# Altium schematic sheet CPU.SchDoc
size A; PageSetup: Record=PageOptions|CenterHorizontal=True|CenterVertical=True|PrintScale=1.05|XCorrection=1.00|YCorrection=1.00|PrintKind=1|BorderSize=5000000|LeftOffset=0|BottomOffset=0|Orientation=2|PaperLength=1000|PaperWidth=1000|Scale=100|PaperSource=262|PrintQuality=600|MediaType=1|DitherType=10|PaperKind=Letter|PrintScaleMode=1
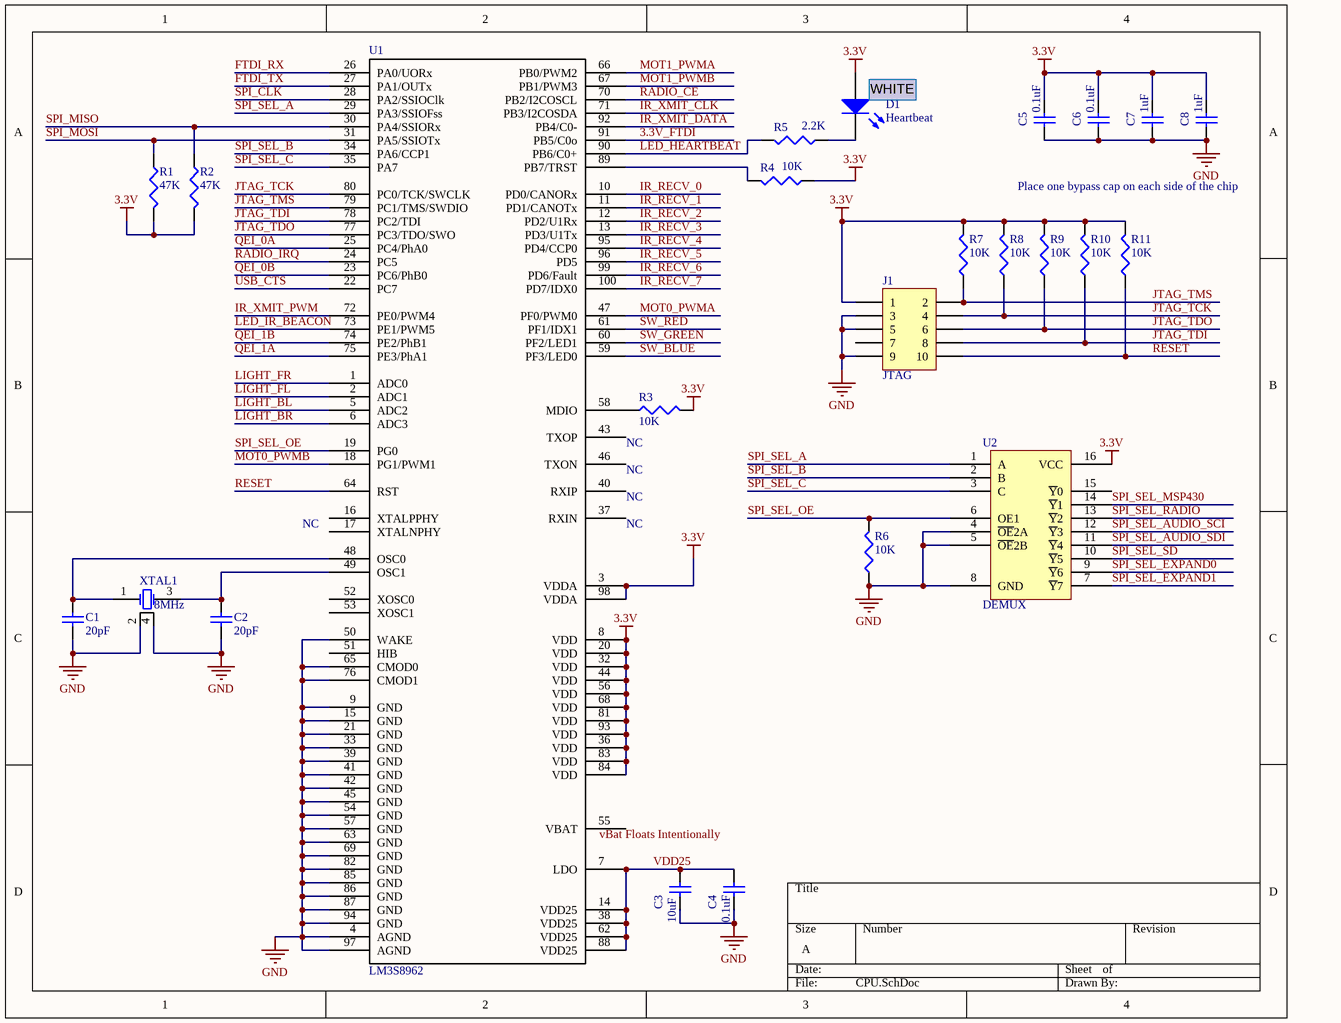
[diagram p0: CPU.SchDoc]

## Parts
C1  value 20pF  [CAPC1005L]  (hidden comment: Cap Semi)
C2  value 20pF  [CAPC1005L]  (hidden comment: Cap Semi)
C3  value 10uF  [CAPC1608L]  (hidden comment: Cap Semi)
C4  value 0.1uF  [CAPC1005L]  (hidden comment: Cap Semi)
C5  value 0.1uF  [CAPC1005L]  (hidden comment: Cap Semi)
C6  value 0.1uF  [CAPC1005L]  (hidden comment: Cap Semi)
C7  value 1uF  [CAPC1608L]  (hidden comment: Cap Semi)
C8  value 1uF  [CAPC1608L]  (hidden comment: Cap Semi)
D1  Heartbeat  [SurfaceMount(603)]
J1  JTAG  [JTAG-10]
R1  value 47K  [RESC1608L]  (hidden comment: Res3)
R2  value 47K  [RESC1608L]  (hidden comment: Res3)
R3  value 10K  [RESC1608L]  (hidden comment: Res3)
R4  value 10K  [RESC1608L]  (hidden comment: Res3)
R5  value 2.2K  [RESC1608L]  (hidden comment: Res3)
R6  value 10K  [RESC1608L]  (hidden comment: Res3)
R7  value 10K  [RESC1608L]  (hidden comment: Res3)
R8  value 10K  [RESC1608L]  (hidden comment: Res3)
R9  value 10K  [RESC1608L]  (hidden comment: Res3)
R10  value 10K  [RESC1608L]  (hidden comment: Res3)
R11  value 10K  [RESC1608L]  (hidden comment: Res3)
U1  LM3S8962  [LQFP-100]
U2  DEMUX  [TSSOP-16]
XTAL1  8MHz  [CRYSTAL]

## Nets
3.3V: C5.2 C6.2 C7.2 C8.2 D1.1(A) J1.1 R1.2 R2.2 R3.2 R4.1 R7.2 R8.2 R9.2 R10.2 R11.2 U1.3(VDDA) U1.8(VDD) U1.20(VDD) U1.32(VDD) U1.36(VDD) U1.44(VDD) U1.56(VDD) U1.68(VDD) U1.81(VDD) U1.83(VDD) U1.84(VDD) U1.93(VDD) U1.98(VDDA) U2.16(VCC)
GND: C1.1 C2.1 C3.1 C4.1 C5.1 C6.1 C7.1 C8.1 J1.3 J1.5 J1.9 R6.1 U1.4(AGND) U1.9(GND) U1.15(GND) U1.21(GND) U1.33(GND) U1.39(GND) U1.41(GND) U1.42(GND) U1.45(GND) U1.50(WAKE) U1.54(GND) U1.57(GND) U1.63(GND) U1.65(CMOD0) U1.69(GND) U1.76(CMOD1) U1.82(GND) U1.85(GND) U1.86(GND) U1.87(GND) U1.94(GND) U1.97(AGND) U2.4(~{OE}2A) U2.5(~{OE}2B) U2.8(GND) XTAL1.2(GND) XTAL1.4(GND)
3.3V_FTDI: U1.91(PB5/C0o)
FTDI_RX: U1.26(PA0/UORx)
FTDI_TX: U1.27(PA1/OUTx)
IR_RECV_0: U1.10(PD0/CANORx)
IR_RECV_1: U1.11(PD1/CANOTx)
IR_RECV_2: U1.12(PD2/U1Rx)
IR_RECV_3: U1.13(PD3/U1Tx)
IR_RECV_4: U1.95(PD4/CCP0)
IR_RECV_5: U1.96(PD5)
IR_RECV_6: U1.99(PD6/Fault)
IR_RECV_7: U1.100(PD7/IDX0)
IR_XMIT_CLK: U1.71(PB3/I2COSDA)
IR_XMIT_DATA: U1.92(PB4/C0-)
IR_XMIT_PWM: U1.72(PE0/PWM4)
JTAG_TCK: J1.4 R8.1 U1.80(PC0/TCK/SWCLK)
JTAG_TDI: J1.8 R10.1 U1.78(PC2/TDI)
JTAG_TDO: J1.6 R9.1 U1.77(PC3/TDO/SWO)
JTAG_TMS: J1.2 R7.1 U1.79(PC1/TMS/SWDIO)
LED_HEARTBEAT: R5.2 U1.90(PB6/C0+)
LED_IR_BEACON: U1.73(PE1/PWM5)
LIGHT_BL: U1.5(ADC2)
LIGHT_BR: U1.6(ADC3)
LIGHT_FL: U1.2(ADC1)
LIGHT_FR: U1.1(ADC0)
MOT0_PWMA: U1.47(PF0/PWM0)
MOT0_PWMB: U1.18(PG1/PWM1)
MOT1_PWMA: U1.66(PB0/PWM2)
MOT1_PWMB: U1.67(PB1/PWM3)
QEI_0A: U1.25(PC4/PhA0)
QEI_0B: U1.23(PC6/PhB0)
QEI_1A: U1.75(PE3/PhA1)
QEI_1B: U1.74(PE2/PhB1)
RADIO_CE: U1.70(PB2/I2COSCL)
RADIO_IRQ: U1.24(PC5)
RESET: J1.10 R11.1 U1.64(RST)
SPI_CLK: U1.28(PA2/SSIOClk)
SPI_MISO: R2.1 U1.30(PA4/SSIORx)
SPI_MOSI: R1.1 U1.31(PA5/SSIOTx)
SPI_SEL_A: U1.29(PA3/SSIOFss) U2.1(A)
SPI_SEL_AUDIO_SCI: U2.12(~{Y}3)
SPI_SEL_AUDIO_SDI: U2.11(~{Y}4)
SPI_SEL_B: U1.34(PA6/CCP1) U2.2(B)
SPI_SEL_C: U1.35(PA7) U2.3(C)
SPI_SEL_EXPAND0: U2.9(~{Y}6)
SPI_SEL_EXPAND1: U2.7(~{Y}7)
SPI_SEL_MSP430: U2.14(~{Y}1)
SPI_SEL_OE: R6.2 U1.19(PG0) U2.6(OE1)
SPI_SEL_RADIO: U2.13(~{Y}2)
SPI_SEL_SD: U2.10(~{Y}5)
SW_BLUE: U1.59(PF3/LED0)
SW_GREEN: U1.60(PF2/LED1)
SW_RED: U1.61(PF1/IDX1)
USB_CTS: U1.22(PC7)
VDD25: C3.2 C4.2 U1.7(LDO) U1.14(VDD25) U1.38(VDD25) U1.62(VDD25) U1.88(VDD25)
NetC1_2: C1.2 U1.48(OSC0) XTAL1.1(OSC1)
NetC2_2: C2.2 U1.49(OSC1) XTAL1.3(OSC2)
NetD1_2: D1.2(K) R5.1
NetR3_1: R3.1 U1.58(MDIO)
NetR4_2: R4.2 U1.89(PB7/TRST)

Not connected (* = marked no-connect by the designer): J1 7; U1 16(XTALPPHY) 17(XTALNPHY) 37(RXIN) 40(RXIP) 43(TXOP) 46(TXON) 51(HIB) 52(XOSC0) 53(XOSC1) 55(VBAT); U2 15(~{Y}0)

## Notes on the sheet
- (near D1) WHITE
- Place one bypass cap on each side of the chip
- NC
- (near U1) NC
- (near U1) vBat Floats Intentionally

## Library data of the parts
C1-C8 = Cap Semi: Capacitor (Semiconductor SIM Model); Published: 8-Jun-2000; LatestRevisionDate: 29-May-2009; LatestRevisionNote: IPC-7351 Footprint Added.; PackageReference: C1206; Publisher: Altium Limited; PackageDescription: Chip Capacitor
D1 = LED
J1 = Header 5X2H: Header, 5-Pin, Dual row, Right Angle; LatestRevisionDate: 17-Jul-2002; LatestRevisionNote: Re-released for DXP Platform.; Publisher: Altium Limited
R1-R11 = Res3: Resistor; Published: 8-Jun-2000; LatestRevisionDate: 29-May-2009; LatestRevisionNote: IPC-7351 Footprint Added.; PackageReference: J1-0603; Publisher: Altium Limited; PackageDescription: Chip Resistor
XTAL1 = Crystal